# Altium schematic sheet MC_Cap_Sensing.SchDoc
size A4
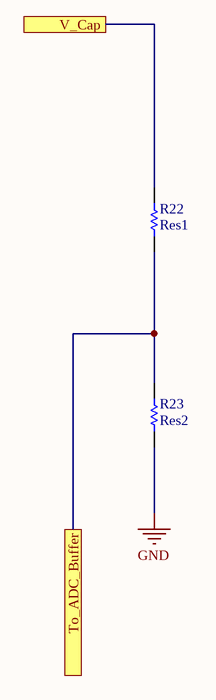
[diagram p0: MC_Cap_Sensing.SchDoc]

## Parts
R22  Res1  [AXIAL-0.3]
R23  Res2  [AXIAL-0.3]

## Ports
To_ADC_Buffer, V_Cap

## Nets
GND: R23.1
To_ADC_Buffer: R22.1 R23.2 ; port To_ADC_Buffer
V_Cap: R22.2 ; port V_Cap

## Library data of the parts
R22 R23 = Res1: Resistor; Published: 8-Jun-2000; LatestRevisionDate: 17-Jul-2002; LatestRevisionNote: Re-released for DXP Platform.; PackageReference: AXIAL-0.3; Publisher: Altium Limited; PackageDescription: Axial Device, Thru-Hole; 2 Leads; 0.3 in Pin Spacing